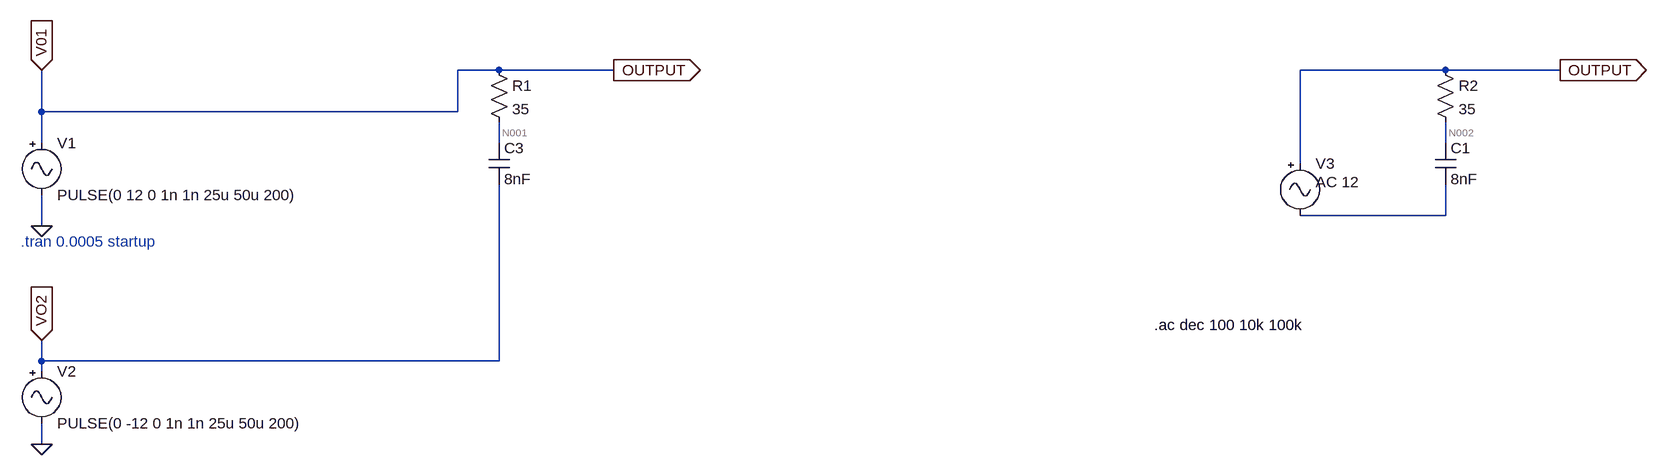
[diagram p0: schematic hydrophoneSim.asc]
hydrophoneSim.asc, the LTspice schematic file:
Version 4.1
SHEET 1 2332 732
WIRE 544 32 480 32
WIRE 720 32 544 32
WIRE 2000 32 1776 32
WIRE 2176 32 2000 32
WIRE -160 96 -160 32
WIRE 480 96 480 32
WIRE 480 96 -160 96
WIRE -160 144 -160 96
WIRE 544 144 544 112
WIRE 2000 144 2000 112
WIRE 1776 176 1776 32
WIRE 2000 256 2000 208
WIRE 2000 256 1776 256
WIRE -160 272 -160 224
WIRE -160 480 -160 448
WIRE 544 480 544 208
WIRE 544 480 -160 480
WIRE -160 496 -160 480
WIRE -160 608 -160 576
FLAG -160 272 0
FLAG 720 32 OUTPUT
IOPIN 720 32 Out
FLAG -160 32 V01
IOPIN -160 32 In
FLAG -160 448 VO2
IOPIN -160 448 In
FLAG -160 608 0
FLAG 2176 32 OUTPUT
IOPIN 2176 32 Out
SYMBOL Misc\\signal -160 128 R0
WINDOW 123 0 0 Left 0
WINDOW 39 0 0 Left 0
SYMATTR InstName V1
SYMATTR Value PULSE(0 12 0 1n 1n 25u 50u 200)
SYMBOL res 528 16 R0
SYMATTR InstName R1
SYMATTR Value 35
SYMBOL cap 528 144 R0
SYMATTR InstName C3
SYMATTR Value 8nF
SYMBOL Misc\\signal -160 480 R0
WINDOW 123 0 0 Left 0
WINDOW 39 0 0 Left 0
SYMATTR InstName V2
SYMATTR Value PULSE(0 -12 0 1n 1n 25u 50u 200)
SYMBOL res 1984 16 R0
SYMATTR InstName R2
SYMATTR Value 35
SYMBOL cap 1984 144 R0
SYMATTR InstName C1
SYMATTR Value 8nF
SYMBOL Misc\\signal 1776 160 R0
WINDOW 123 24 44 Left 2
WINDOW 39 0 0 Left 0
SYMATTR InstName V3
SYMATTR Value ""
SYMATTR Value2 AC 12
TEXT -192 296 Left 2 ;.tran 0.0005 startup
TEXT 1552 424 Left 2 !.ac dec 100 10k 100k

The netlist it stands for:
* hydrophoneSim.asc
V1 V01 0 PULSE(0 12 0 1n 1n 25u 50u 200)
R1 V01 N001 35
C3 N001 VO2 8nF
V2 VO2 0 PULSE(0 -12 0 1n 1n 25u 50u 200)
R2 V01 N002 35
C1 N002 N003 8nF
V3 V01 N003 AC 12
* .tran 0.0005 startup
.ac dec 100 10k 100k
.backanno
.end

* Results of the author's LTspice run, read from the files saved beside the schematic
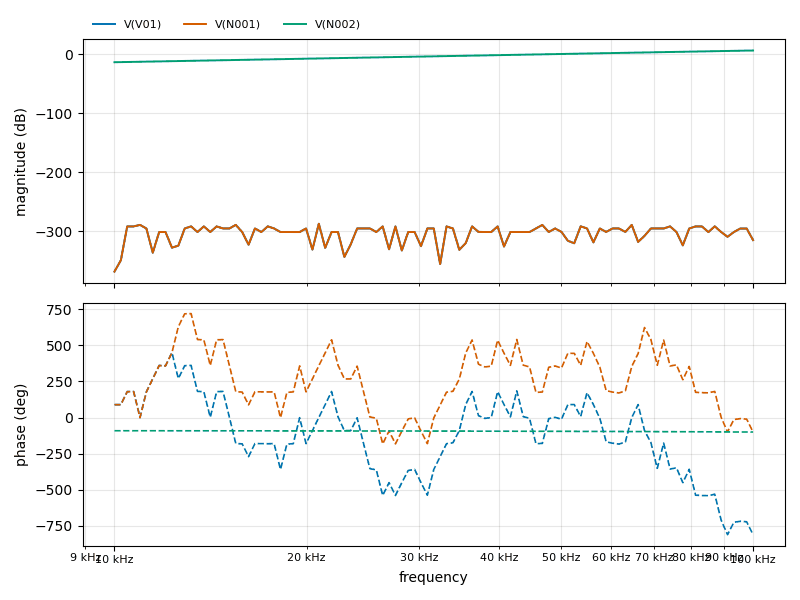
[diagram p1: AC Analysis of hydrophoneSim.asc, plotted from the saved traces]
* AC Analysis, 1 run:
*   V(V01): -368.03 dB at 10 kHz, -314.55 dB at 100 kHz, peak -287.05 dB at 20.89 kHz, 3 dB below the peak at 20.86 kHz and 20.93 kHz
*   V(N001): -368.03 dB at 10 kHz, -314.68 dB at 100 kHz, peak -287.06 dB at 20.89 kHz, 3 dB below the peak at 20.86 kHz and 20.93 kHz
*   V(N002): -13.51 dB at 10 kHz, 6.36 dB at 100 kHz, peak 6.36 dB at 100 kHz, 3 dB below the peak at 70.17 kHz